# EAGLE design HMC5883L_Breakout-v11 (EAGLE 6.4)
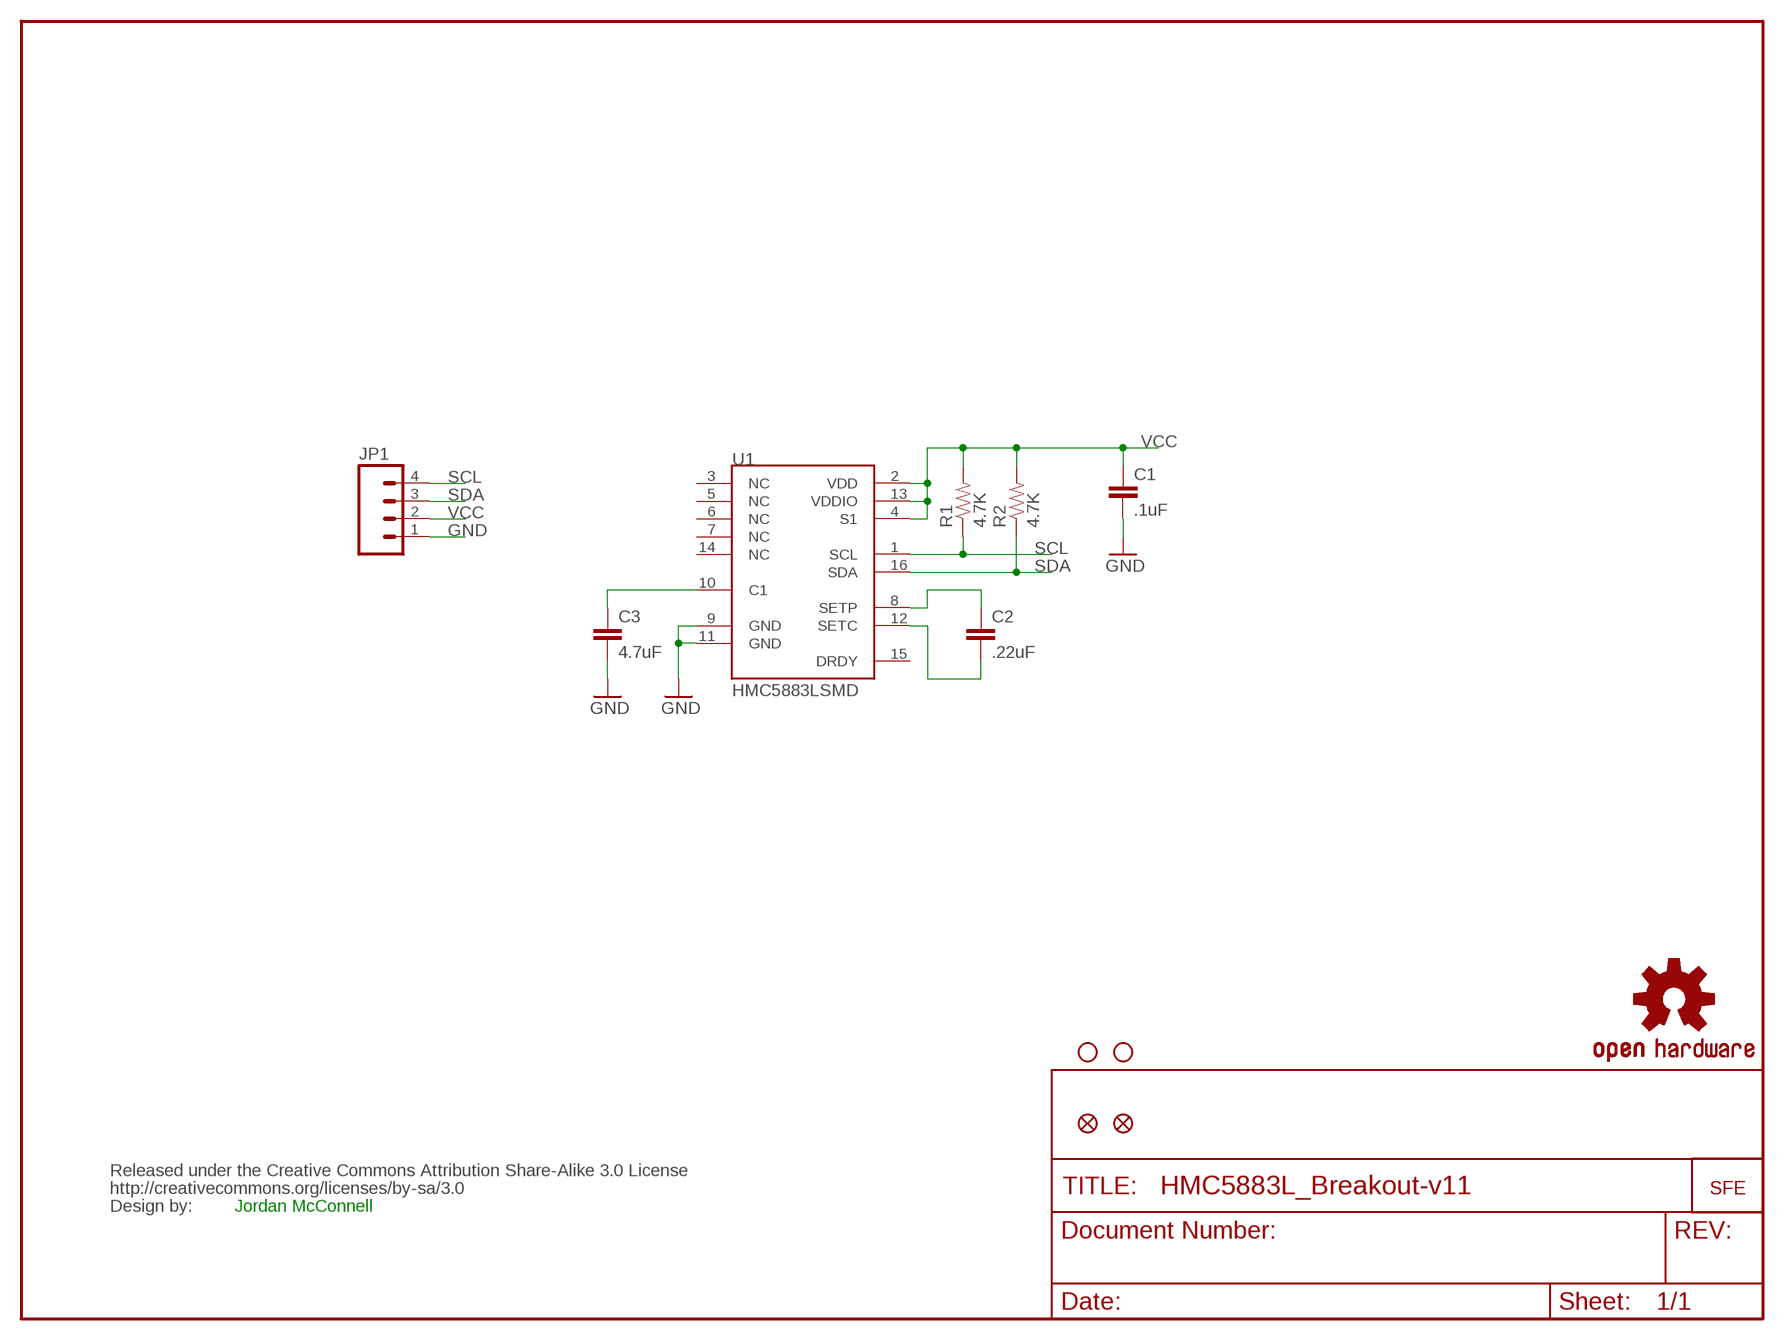
[diagram p0: schematic, sheet 1]

## Parts
C1  .1uF  CAP0402-CAP  [0402-CAP]
C2  .22uF  CAP0402-CAP  [0402-CAP]
C3  4.7uF  CAP0402-CAP  [0402-CAP]
JP1  M04PTH  [1X04]
JP2  STAND-OFF  [STAND-OFF]
JP3  STAND-OFF  [STAND-OFF]
JP4  LOGO-SFESK  [SFE-LOGO-FLAME]
JP5  FIDUCIAL1X2.5  [FIDUCIAL-1X2.5]
JP6  FIDUCIAL1X2.5  [FIDUCIAL-1X2.5]
R1  4.7K  RESISTOR0402-RES  [0402-RES]
R2  4.7K  RESISTOR0402-RES  [0402-RES]
U1  HMC5883LSMD  [16LPCC]
U$1  CREATIVE_COMMONS  [CREATIVE_COMMONS]
U$2  OSHW-LOGOM  [OSHW-LOGO-M]

## Nets
GND: C1.2 C3.2 JP1.1 U1.9(GND) U1.11(GND)
N$1: C3.1 U1.10(C1)
N$4: C2.1 U1.8(SETP)
N$5: C2.2 U1.12(SETC)
SCL: JP1.4 R1.1 U1.1(SCL)
SDA: JP1.3 R2.1 U1.16(SDA)
VCC: C1.1 JP1.2 R1.2 R2.2 U1.2(VDD) U1.4(S1) U1.13(VDDIO)
Unconnected: U1.3(NC) U1.5(NC) U1.6(NC) U1.7(NC) U1.14(NC) U1.15(DRDY)

## Notes on the sheet
- Jordan McConnell

## Library data of the parts
C1-C3 = SparkFun:CAP: Capacitor Standard 0603 ceramic capacitor, and 0.1" leaded capacitor.
JP1 = SparkFun:M04: Header 4 Standard 4-pin 0.1" header. Use with straight break away headers (SKU : PRT-00116), right angle break away headers (PRT-00553), swiss pins (PRT-00743), machine pins (PRT-00117), and female headers (PRT-00115). Molex polarized connector foot print use with SKU : PRT-08231 with associated crimp pins and housings. 1MM SMD Version SKU: PRT-10208
JP2 JP3 = SparkFun:STAND-OFF: Stand Off This is the mechanical footprint for a #4 phillips button head screw. Use the keepout ring to avoid running the screw head into surrounding components. SKU : PRT-00447
JP4 = SparkFun:LOGO-SFE: Spark Fun Electronics PCB Logo This is the standard Spark Fun Electronics PCB logo.
JP5 JP6 = abes:FIDUCIAL: Fiducial Alignment Points Various fiducial points for machine vision alignment.
R1 R2 = SparkFun:RESISTOR: Resistor Basic schematic elements and footprints for 0603, 1206, and PTH resistors.
U1 = SparkFun:HMC5883L: 3 Axis Digital Compass IC
U$1 = SparkFun:CREATIVE_COMMONS
U$2 = SparkFun:OSHW-LOGO: Open Source Hardware Logo This logo indicates the piece of hardware it is found on incorporates a OSHW license and/or adheres to the definition of open source hardware found here: http://freedomdefined.org/OSHW

## Board
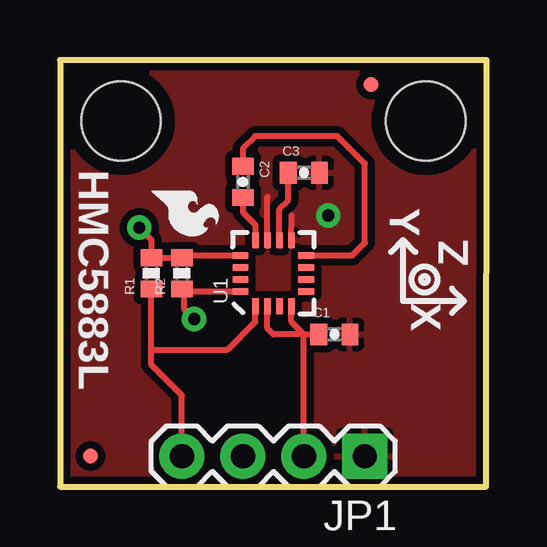
[diagram p1: board, top side]
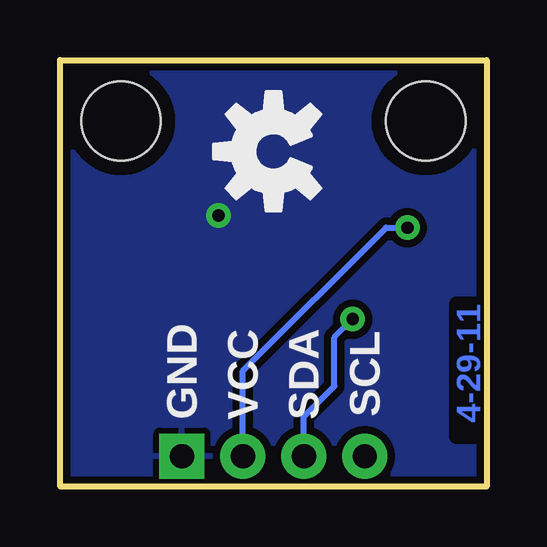
[diagram p2: board, bottom side, seen from below]

Size 17.78 x 17.78 mm. Coordinates in mm from the lower left corner, seen from the top.
Outline: 0,0 17.76,0 17.78,17.78 0,17.78 0,0
Copper layers (1*16): Top 0.035mm / dielectric 1.5mm / Bottom 0.035mm
Design rules "SparkFun": minimum track width 8mil, minimum drill 20mil, track to track 8mil, track to pad 8mil, pad to pad 8mil, via to via 8mil, smd to smd 8mil, copper to edge 10mil, drill to drill 8mil, minimum pad ring 12mil, minimum via ring 10mil, stop-mask expansion 4mil, vias tented up to drill 25mil, thermal gap 10mil

### Footprints (pad centres in the part's own frame; a part is rotated, then mirrored left to right if it is on the bottom)
0402-CAP = smd 0.7 x 0.9: 1 -0.65,0; 2 0.65,0
1X04 = drill 1.016 pad 1.88 square: 1 0,0 | drill 1.016 pad 1.88: 2 2.54,0; 3 5.08,0; 4 7.62,0
STAND-OFF = hole 3.302: 0,0
FIDUCIAL-1X2.5 = smd 0.635 x 0.635: 1 0,0
0402-RES = smd 0.7 x 0.9: 1 -0.65,0; 2 0.65,0
16LPCC = smd 0.65 x 0.28: 1 -1.37,0.75; 2 -1.37,0.25; 3 -1.37,-0.25; 4 -1.37,-0.75; 9 1.37,-0.75; 10 1.37,-0.25; 11 1.37,0.25; 12 1.37,0.75 | smd 0.28 x 0.65: 5 -0.75,-1.37; 6 -0.25,-1.37; 7 0.25,-1.37; 8 0.75,-1.37; 13 0.75,1.37; 14 0.25,1.37; 15 -0.25,1.37; 16 -0.75,1.37

### Placement (x,y rotation side)
C1  11.43,6.35 0 top
C2  7.62,12.7 270 top
C3  10.16,13.08 0 top
JP1  12.7,1.27 180 top
JP2  2.54,15.24 0 top
JP3  15.24,15.24 0 top
JP4  3.81,12.32 270 top
JP5  1.27,1.27 0 top
JP6  12.95,16.76 0 top
R1  3.81,8.89 90 top
R2  5.08,8.89 90 top
U1  8.89,8.89 90 top
U$1  3.81,-8.89 0 top  (outside the outline)
U$2  8.89,13.97 90 bottom

### Tracks (layer width: path | path; a pad name or v marks a point on that pad's centre or on a via)
GND  (via drill 0.51)
  Top 0.254: U1.11 8.64,12.06 | U1.9 9.65,11.3
  other vias: 11.18,11.3
  pour Bottom (isolate 0.305): 0,17.78 17.78,17.78 17.78,0 0,0
  pour Top (isolate 0.305): 0,17.78 17.78,17.78 17.78,0 0,0
N$1
  Top 0.254: U1.10 9.14,11.55 9.51,11.92 C3.1
N$4
  Top 0.254: 10.27,9.65 U1.8 12.18,9.64 12.7,10.16 12.7,13.46 11.56,14.61 8.13,14.61 7.62,14.1 C2.1
N$5
  Top 0.254: U1.12 8.14,10.91 7.62,11.43 C2.2
SCL
  Top 0.254: 3.81,5.71 3.81,5.08 5.08,3.81 JP1.4 | 3.81,5.71 R1.1 | U1.1 8.14,6.87 6.99,5.71 3.81,5.71
SDA  (via drill 0.51)
  Top 0.254: 5.18,8.14 U1.16 | 5.18,8.14 R2.1 | 5.18,8.14 5.18,7.39 v5.59,6.99
  Bottom 0.254: v5.59,6.99 6.35,6.22 6.35,4.19 7.62,2.92 JP1.3
VCC  (via drill 0.51)
  Top 0.254: U1.13 5.18,9.64 R2.2 R1.2 | R1.2 3.79,9.53 | U1.4 9.64,6.87 10.16,6.35 | JP1.2 10.16,6.35 | 10.16,6.35 C1.1 | U1.2 8.64,6.6 8.89,6.35 10.16,6.35 | R1.2 3.81,10.29 v3.3,10.79
  Bottom 0.254: JP1.2 10.16,4.83 4.19,10.79 v3.3,10.79

### Text on the board
Bottom: 4-29-11
tPlace: HMC5883L | Y | Z | X
bPlace: SCL | SDA | VCC | GND